# Altium schematic sheet OV_OC.SchDoc
size A4; Author: Mikołaj Pichita; CompanyName: AGH University of Science and Technology; SheetNumber: 13; SheetTotal: 16
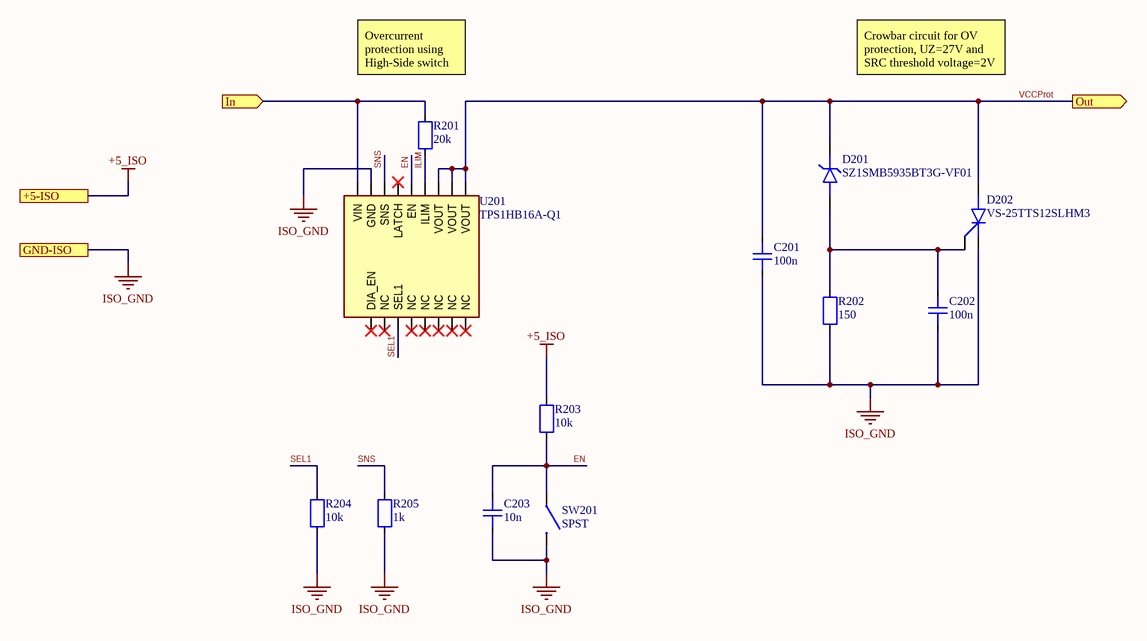
[diagram p0: OV_OC.SchDoc]

## Parts
C201  100n  [CAP0603]
C202  100n  [CAP0603]
C203  10n  [CAP0603]
D201  SZ1SMB5935BT3G-VF01  [DIOM5334X23N]
D202  VS-25TTS12SLHM3  [DPAK254P1524X483-3N]
R201  20k  [RES0603]
R202  150  [RES0603]
R203  10k  [RES0603]
R204  10k  [RES0603]
R205  1k  [RES0603]
SW201  SPST  [SPSTSW]
U201  TPS1HB16A-Q1  [TSOP65P640X120_HS-17N]

## Ports
+5-ISO (see measurements[2B], full_bridge[1B], isolator[4B], measurements[1B], power_supply[3B], testpoint[2A]), GND-ISO (see measurements[2B], full_bridge[1B], input_filter[2C], isolator[4B], measurements[1B], output_filter[1B], power_supply[3B], testpoint[2A], voltage_sense[1B]), In (in, see measurements[2B]), Out (out, see measurements[2B])

## Nets
+5_ISO: R203.1 ; port +5-ISO
ISO_GND: C201.2 C202.2 C203.2 D202.1(Cathode) R202.2 R204.2 R205.2 SW201.2 U201.1(GND) ; port GND-ISO
EN: C203.1 R203.2 SW201.1 U201.4(EN)
ILIM: R201.2 U201.5(ILIM)
In: R201.1 U201.17(VIN) ; port In
SEL1: R204.1 U201.14(SEL1)
SNS: R205.1 U201.2(SNS)
VCCProt: C201.1 D201.1(Cathode) D202.4(Anode) U201.6(VOUT) U201.7(VOUT) U201.8(VOUT) ; port Out
NetC202_1: C202.1 D201.2(Anode) D202.3(Gate) R202.1

Not connected (* = marked no-connect by the designer): U201 3(LATCH)* 9(NC)* 10(NC)* 11(NC)* 12(NC)* 13(NC)* 15(NC)* 16(DIA_EN)*

## Notes on the sheet
- (near R201) Overcurrent protection using High-Side switch
- Crowbar circuit for OV protection, UZ=27V and SRC threshold voltage=2V
- Nazwa projektu
- Nazwa dokumentu
- Nazwa firmy:
- Autor:
- Osoba sprawdzająca:
- Data:

## Library data of the parts
C201-C203 = Capacitor: Value: *; HelpURL: *; MPN: *; Supplier: *; SupplierPartNumber: *
  C201 C203: Supplier 1: Mouser; Supplier Part Number 1: 80-C0603C202J2G
D201 = Zener: Value: *; HelpURL: *; MPN: *; Supplier: *; SupplierPartNumber: *; Supplier 1: Mouser; Supplier Part Number 1: 863-SZ1SMB5935BT3GV1
D202 = VS-25TTS12SLHM3: Thyristor, Surface Mount, Phase Control SCR, 16 A; Value: *; HelpURL: *; MPN: *; Supplier: *; SupplierPartNumber: *; Supplier 1: Mouser; Supplier Part Number 1: 78-VS-25TTS12SLHM3
R201-R205 = Resistor: Value: *; HelpURL: *; MPN: *; Supplier: *; SupplierPartNumber: *; Supplier 1: Mouser
  R201: Supplier Part Number 1: 667-ERJ-H3ED2002V
  R202: Supplier Part Number 1: 71-RCA0603150RJNEA
  R203 R204: Supplier Part Number 1: 71-CRCW060310K0FKED
  R205: Supplier Part Number 1: 652-CR0603FX-1001ELF
SW201 = 1DS04-254-2-01BK-SMT: SPST 24VDC switch; Value: *; HelpURL: *; MPN: *; Supplier: *; SupplierPartNumber: *; Supplier 1: Mouser; Supplier Part Number 1: 490-DS04254201BK-SMT
U201 = TPS1HB16A-Q1: 40-V, 16-mΩ, 1-ch automotive smart high-side switch with adjustable current limit; Value: *; HelpURL: *; MPN: *; Supplier: *; SupplierPartNumber: *; Supplier 1: Mouser; Supplier Part Number 1: 595-TPS1HB16AQPWPRQ1